# Altium schematic sheet bot_schem_rev10_3.SchDoc
size A
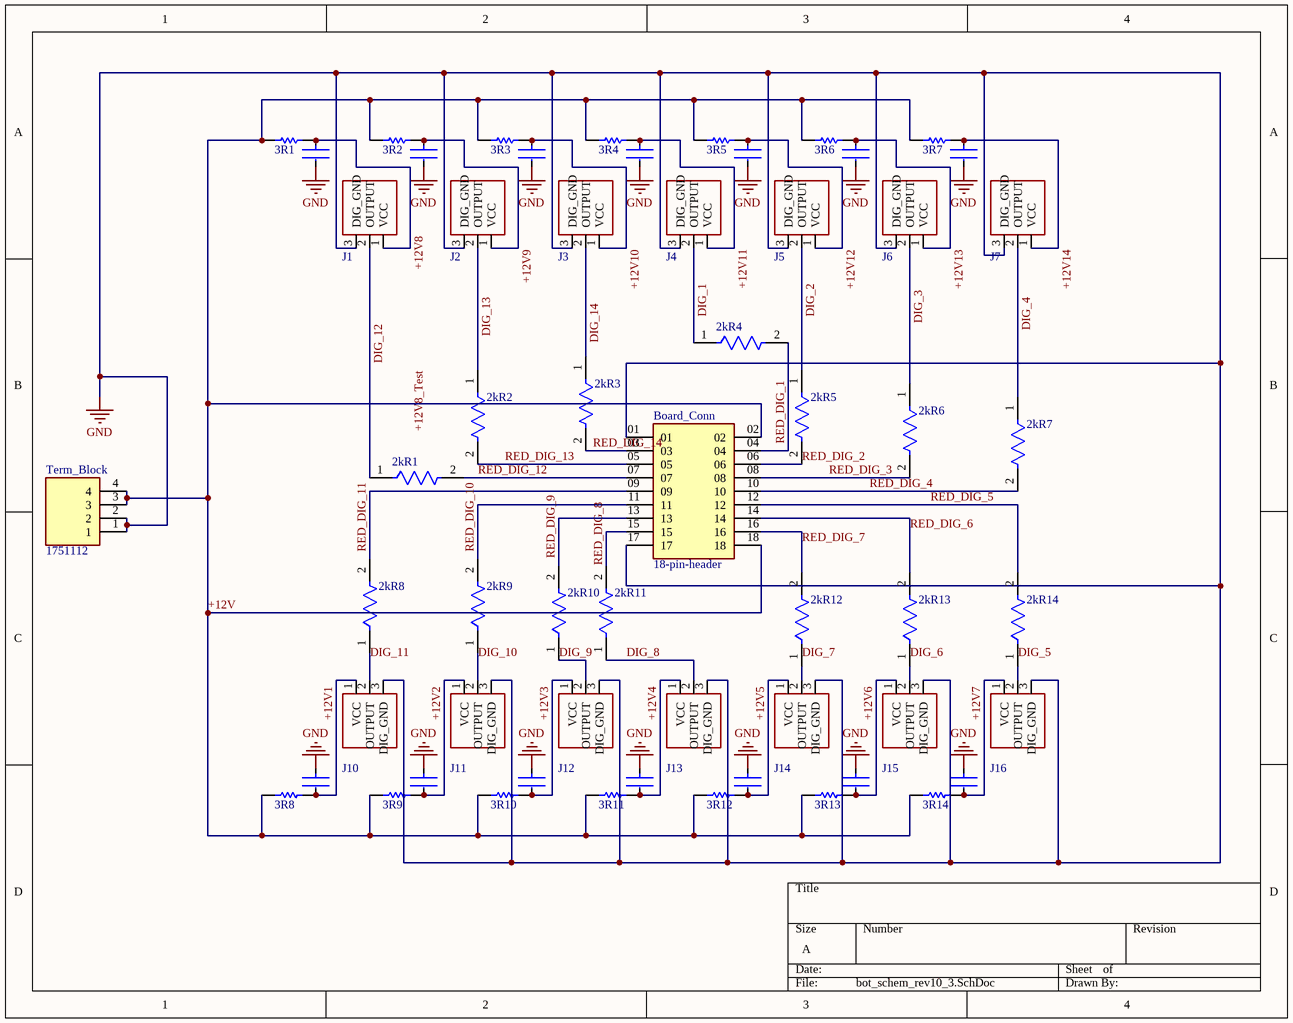
[diagram p0: bot_schem_rev10_3.SchDoc]

## Parts
2kR1  CRCW06031K80FKEA  [2kOhm]  (value not drawn)
2kR2  CRCW06031K80FKEA  [2kOhm]  (value not drawn)
2kR3  CRCW06031K80FKEA  [2kOhm]  (value not drawn)
2kR4  CRCW06031K80FKEA  [2kOhm]  (value not drawn)
2kR5  CRCW06031K80FKEA  [2kOhm]  (value not drawn)
2kR6  CRCW06031K80FKEA  [2kOhm]  (value not drawn)
2kR7  CRCW06031K80FKEA  [2kOhm]  (value not drawn)
2kR8  CRCW06031K80FKEA  [2kOhm]  (value not drawn)
2kR9  CRCW06031K80FKEA  [2kOhm]  (value not drawn)
2kR10  CRCW06031K80FKEA  [2kOhm]  (value not drawn)
2kR11  CRCW06031K80FKEA  [2kOhm]  (value not drawn)
2kR12  CRCW06031K80FKEA  [2kOhm]  (value not drawn)
2kR13  CRCW06031K80FKEA  [2kOhm]  (value not drawn)
2kR14  CRCW06031K80FKEA  [2kOhm]  (value not drawn)
3R1  ERJ-8GEYJ3R0V  [3 ohm]  (value not drawn)
3R2  ERJ-8GEYJ3R0V  [3 ohm]  (value not drawn)
3R3  ERJ-8GEYJ3R0V  [3 ohm]  (value not drawn)
3R4  ERJ-8GEYJ3R0V  [3 ohm]  (value not drawn)
3R5  ERJ-8GEYJ3R0V  [3 ohm]  (value not drawn)
3R6  ERJ-8GEYJ3R0V  [3 ohm]  (value not drawn)
3R7  ERJ-8GEYJ3R0V  [3 ohm]  (value not drawn)
3R8  ERJ-8GEYJ3R0V  [3 ohm]  (value not drawn)
3R9  ERJ-8GEYJ3R0V  [3 ohm]  (value not drawn)
3R10  ERJ-8GEYJ3R0V  [3 ohm]  (value not drawn)
3R11  ERJ-8GEYJ3R0V  [3 ohm]  (value not drawn)
3R12  ERJ-8GEYJ3R0V  [3 ohm]  (value not drawn)
3R13  ERJ-8GEYJ3R0V  [3 ohm]  (value not drawn)
3R14  ERJ-8GEYJ3R0V  [3 ohm]  (value not drawn)
Board_Conn  18-pin-header  [18 pin header]
C1  C0805C104K5RACTU  [100nF]  (value not drawn)
C2  C0805C104K5RACTU  [100nF]  (value not drawn)
C3  C0805C104K5RACTU  [100nF]  (value not drawn)
C4  C0805C104K5RACTU  [100nF]  (value not drawn)
C5  C0805C104K5RACTU  [100nF]  (value not drawn)
C6  C0805C104K5RACTU  [100nF]  (value not drawn)
C7  C0805C104K5RACTU  [100nF]  (value not drawn)
C8  C0805C104K5RACTU  [100nF]  (value not drawn)
C9  C0805C104K5RACTU  [100nF]  (value not drawn)
C10  C0805C104K5RACTU  [100nF]  (value not drawn)
C11  C0805C104K5RACTU  [100nF]  (value not drawn)
C12  C0805C104K5RACTU  [100nF]  (value not drawn)
C13  C0805C104K5RACTU  [100nF]  (value not drawn)
C14  C0805C104K5RACTU  [100nF]  (value not drawn)
J1  IF-D95T  [IF-D95]  (value not drawn)
J2  IF-D95T  [IF-D95]  (value not drawn)
J3  IF-D95T  [IF-D95]  (value not drawn)
J4  IF-D95T  [IF-D95]  (value not drawn)
J5  IF-D95T  [IF-D95]  (value not drawn)
J6  IF-D95T  [IF-D95]  (value not drawn)
J7  IF-D95T  [IF-D95]  (value not drawn)
J10  IF-D95T  [IF-D95]  (value not drawn)
J11  IF-D95T  [IF-D95]  (value not drawn)
J12  IF-D95T  [IF-D95]  (value not drawn)
J13  IF-D95T  [IF-D95]  (value not drawn)
J14  IF-D95T  [IF-D95]  (value not drawn)
J15  IF-D95T  [IF-D95]  (value not drawn)
J16  IF-D95T  [IF-D95]  (value not drawn)
Term_Block  1751112  [4-pin terminal HORIZONTAL]

## Nets
GND: Board_Conn.01 Board_Conn.17 C1.2 C2.2 C3.2 C4.2 C5.2 C6.2 C7.2 C8.1 C9.1 C10.1 C11.1 C12.1 C13.1 C14.1 J1.3(DIG_GND) J2.3(DIG_GND) J3.3(DIG_GND) J4.3(DIG_GND) J5.3(DIG_GND) J6.3(DIG_GND) J7.3(DIG_GND) J10.3(DIG_GND) J11.3(DIG_GND) J12.3(DIG_GND) J13.3(DIG_GND) J14.3(DIG_GND) J15.3(DIG_GND) J16.3(DIG_GND) Term_Block.1 Term_Block.2
+12V: 3R1.1 3R2.1 3R3.1 3R4.1 3R5.1 3R6.1 3R7.1 3R8.1 3R9.1 3R10.1 3R11.1 3R12.1 3R13.1 3R14.1 Board_Conn.02 Board_Conn.18 Term_Block.3 Term_Block.4
+12V1: 3R8.2 C8.2 J10.1(VCC)
+12V2: 3R9.2 C9.2 J11.1(VCC)
+12V3: 3R10.2 C10.2 J12.1(VCC)
+12V4: 3R11.2 C11.2 J13.1(VCC)
+12V5: 3R12.2 C12.2 J14.1(VCC)
+12V6: 3R13.2 C13.2 J15.1(VCC)
+12V7: 3R14.2 C14.2 J16.1(VCC)
+12V8: 3R1.2 C1.1 J1.1(VCC)
+12V9: 3R2.2 C2.1 J2.1(VCC)
+12V10: 3R3.2 C3.1 J3.1(VCC)
+12V11: 3R4.2 C4.1 J4.1(VCC)
+12V12: 3R5.2 C5.1 J5.1(VCC)
+12V13: 3R6.2 C6.1 J6.1(VCC)
+12V14: 3R7.2 C7.1 J7.1(VCC)
DIG_1: 2kR4.1 J4.2(OUTPUT)
DIG_2: 2kR5.1 J5.2(OUTPUT)
DIG_3: 2kR6.1 J6.2(OUTPUT)
DIG_4: 2kR7.1 J7.2(OUTPUT)
DIG_8: 2kR11.1 J13.2(OUTPUT)
DIG_9: 2kR10.1 J12.2(OUTPUT)
DIG_10: 2kR9.1 J11.2(OUTPUT)
DIG_11: 2kR8.1 J10.2(OUTPUT)
DIG_12: 2kR1.1 J1.2(OUTPUT)
DIG_13: 2kR2.1 J2.2(OUTPUT)
DIG_14: 2kR3.1 J3.2(OUTPUT)
RED_DIG_1: 2kR4.2 Board_Conn.04
RED_DIG_2: 2kR5.2 Board_Conn.06
RED_DIG_3: 2kR6.2 Board_Conn.08
RED_DIG_4: 2kR7.2 Board_Conn.10
RED_DIG_5: 2kR14.2 Board_Conn.12
RED_DIG_6: 2kR13.2 Board_Conn.14
RED_DIG_7: 2kR12.2 Board_Conn.16
RED_DIG_8: 2kR11.2 Board_Conn.15
RED_DIG_9: 2kR10.2 Board_Conn.13
RED_DIG_10: 2kR9.2 Board_Conn.11
RED_DIG_11: 2kR8.2 Board_Conn.09
RED_DIG_12: 2kR1.2 Board_Conn.07
RED_DIG_13: 2kR2.2 Board_Conn.05
RED_DIG_14: 2kR3.2 Board_Conn.03
Net2kR12_1: 2kR12.1 J14.2(OUTPUT)
Net2kR13_1: 2kR13.1 J15.2(OUTPUT)
Net2kR14_1: 2kR14.1 J16.2(OUTPUT)

## Notes on the sheet
- Labels drawn without touching a wire or pin: +12V8_Test, DIG_5, DIG_6, DIG_7

## Library data of the parts
2kR1-2kR14 = CRCW06031K80FKEA: Res Thick Film 0603 1.8K Ohm 1% 1/10W ±100ppm/°C Molded SMD Paper T/R; Manufacturer: Vishay; Resistance: 1.8kR; Power Rating: 100mW; Voltage Rating: 75V; Supplier 1: RSComponents; Manufacturer Part Number: CRCW06031K80FKEA; RoHS: Yes; Category: Chip SMD Resistors; Stock 1: 7900; Pricing 1: 50=0.06500, 500=0.06000, 1000=0.05600, 2000=0.05200, 4000=0.04800 (USD); Case/Package: 0603; Case Code (Metric): 1608; Case Code (Imperial): 0603; Contact Plating: Tin; Weight: 7.1E-05oz; Size Code: 0603; Min Operating Temperature: -55°C; Max Operating Temperature: 155°C; Resistor Type: Thick Film; Tolerance: 1%; Packaging: Tape and Reel; Package Quantity: 5000; Temperature Coefficient: 100ppm/°C; Series: CRCW; Resistance Tolerance: 1%; Number of Terminations: 2; Max Power Dissipation: 100mW; Termination: SMD/SMT; Construction: Rectangular; Voltage Rating (DC): 75V; Features: Automotive AEC-Q200; Technology: THICK FILM; Length: 1.55mm; Width: 0.033inch; Height: 0.45mm; Depth: 0.85mm; Radiation Hardening: No; RoHS Compliant: Yes; REACH SVHC: Unknown; Military Standard: Not; Lead Free: Lead Free; ComponentLink1URL: https://datasheet.ciiva.com/11809/0900766b80d98afc-11809198.pdf?src-supplier=RSComponents; ComponentLink1Description: https://datasheet.ciiva.com/11809/0900766b80d98afc-11809198.pdf?src-supplier=RSComponents; ComponentLink2URL: https://datasheet.ciiva.com/2559/dcrcwe3-2559458.pdf?src-supplier=Digi-Key; ComponentLink2Description: https://datasheet.ciiva.com/2559/dcrcwe3-2559458.pdf?src-supplier=Digi-Key; ComponentLink3URL: https://datasheet.ciiva.com/2559/dcrcwe3-2559459.pdf?src-supplier=Digi-Key; ComponentLink3Description: https://datasheet.ciiva.com/2559/dcrcwe3-2559459.pdf?src-supplier=Digi-Key; ComponentLink4URL: https://datasheet.ciiva.com/2559/dcrcwe3-2559460.pdf?src-supplier=Digi-Key; ComponentLink4Description: https://datasheet.ciiva.com/2559/dcrcwe3-2559460.pdf?src-supplier=Digi-Key; ComponentLink5URL: https://datasheet.ciiva.com/3257/dcrcwe3-3257191.pdf?src-supplier=Avnet; ComponentLink5Description: https://datasheet.ciiva.com/3257/dcrcwe3-3257191.pdf?src-supplier=Avnet; ComponentLink6URL: https://datasheet.ciiva.com/5547/dcrcwe3-109170-5547689.pdf?src-supplier=Mouser; ComponentLink6Description: https://datasheet.ciiva.com/5547/dcrcwe3-109170-5547689.pdf?src-supplier=Mouser; ComponentLink7URL: https://datasheet.ciiva.com/26314/fld-crcw-e3-data-en-26314680.pdf?src-supplier=Distrelec; ComponentLink7Description: https://datasheet.ciiva.com/26314/fld-crcw-e3-data-en-26314680.pdf?src-supplier=Distrelec; ComponentLink8URL: https://datasheet.ciiva.com/22872/70201119-22872444.pdf?src-supplier=Allied+Electronics; ComponentLink8Description: https://datasheet.ciiva.com/22872/70201119-22872444.pdf?src-supplier=Allied+Electronics; ComponentLink9URL: https://datasheet.ciiva.com/7673/1533075-7673143.pdf?src-supplier=Element14; ComponentLink9Description: https://datasheet.ciiva.com/7673/1533075-7673143.pdf?src-supplier=Element14
3R1-3R14 = ERJ-8GEYJ3R0V: Res Thick Film 1206 3 Ohm 5% 1/4W -100ppm/C to 600ppm/C Molded SMD Punched Carrier T/R; Manufacturer: Panasonic; Resistance: 3R; Temperature Coefficient: 600ppm/°C; Power Rating: 250mW; Voltage Rating: 200V; Supplier 1: Digi-Key; Supplier Part Number 1: P3.0ECT-ND; Manufacturer Part Number: ERJ-8GEYJ3R0V; RoHS: Yes; Category: Chip SMD Resistors; Stock 1: 140112; Pricing 1: 1=0.10000, 10=0.05900, 100=0.02420, 1000=0.01087, 2500=0.00943 (USD); Mount: Surface Mount; Case/Package: 1206; Case Code (Metric): 3216; Case Code (Imperial): 1206; Contact Plating: Tin; Min Operating Temperature: -55°C; Max Operating Temperature: 155°C; Tolerance: 5%; Packaging: Tape and Reel; Resistor Type: Thick Film; Number of Terminations: 2; Max Power Dissipation: 250mW; Voltage Rating (DC): 200V; Package Quantity: 1; Features: Automotive AEC-Q200; Series: ERJ; Construction: Rectangular; Resistance Tolerance: 5%; Length: 3.2mm; Width: 0.063inch; Height: 0.028inch; Depth: 1.6mm; Radiation Hardening: No; Lead Free: Lead Free; RoHS Compliant: Yes; Military Standard: Not; REACH SVHC: No SVHC; ComponentLink1URL: https://datasheet.ciiva.com/30180/4aoa0000ce1-30180605.pdf?src-supplier=Onlinecomponents.com; ComponentLink1Description: https://datasheet.ciiva.com/30180/4aoa0000ce1-30180605.pdf?src-supplier=Onlinecomponents.com; ComponentLink2URL: https://datasheet.ciiva.com/17213/aoa0000ce1-17213823.pdf?src-supplier=Avnet+Europe; ComponentLink2Description: https://datasheet.ciiva.com/17213/aoa0000ce1-17213823.pdf?src-supplier=Avnet+Europe; ComponentLink3URL: https://datasheet.ciiva.com/46387/1500035-46387035.pdf?src-supplier=Element14; ComponentLink3Description: https://datasheet.ciiva.com/46387/1500035-46387035.pdf?src-supplier=Element14; ComponentLink4URL: https://datasheet.ciiva.com/46374/1500035-46374140.pdf?src-supplier=Element14; ComponentLink4Description: https://datasheet.ciiva.com/46374/1500035-46374140.pdf?src-supplier=Element14; ComponentLink5URL: https://datasheet.ciiva.com/9196/aoa0000ce1-9196703.pdf?src-supplier=Avnet; ComponentLink5Description: https://datasheet.ciiva.com/9196/aoa0000ce1-9196703.pdf?src-supplier=Avnet
Board_Conn = 18-pin-header: System: Connector
C1-C14 = C0805C104K5RACTU: Cap Ceramic 0.1uF 50V X7R 10% SMD 2.0 x 1.2 mm 125 C Paper T/R; Manufacturer: KEMET; Voltage: 500V; Supplier 1: Digi-Key; Supplier Part Number 1: 399-1170-1-ND; Manufacturer Part Number: C0805C104K5RACTU; RoHS: Yes; Category: Ceramic Capacitors; Stock 1: 2447786; Pricing 1: 1=0.15000, 10=0.11000, 50=0.06220, 100=0.05150, 500=0.03612, 1000=0.02991 (USD); Mount: Surface Mount,PCB; Case/Package: 0805; Number of Pins: 2; Case Code (Imperial): 0805; Case Code (Metric): 2012; Contact Plating: Tin,Matte; Dielectric Material: Ceramic; Min Operating Temperature: -55°C; Max Operating Temperature: 125°C; Capacitance: 100nF; Voltage Rating: 50V; Tolerance: 10%; Packaging: Tape and Reel; Dielectric: X7R; Package Quantity: 4000; Voltage Rating (DC): 50V; Series: C0805C; Termination: SMD/SMT; Construction: Flat; Length: 2mm; Width: 1.2mm; Height: 0.9mm; Thickness: 0.035inch; Depth: 1.25mm; Lead Pitch: 0.75mm; Radiation Hardening: No; RoHS Compliant: Yes; REACH SVHC: No SVHC; ComponentLink1URL: https://datasheet.ciiva.com/28682/1851736-28682232.pdf?src-supplier=Element14; ComponentLink1Description: https://datasheet.ciiva.com/28682/1851736-28682232.pdf?src-supplier=Element14; ComponentLink2URL: https://datasheet.ciiva.com/14589/70095383-14589048.pdf?src-supplier=Allied+Electronics; ComponentLink2Description: https://datasheet.ciiva.com/14589/70095383-14589048.pdf?src-supplier=Allied+Electronics; ComponentLink3URL: https://datasheet.ciiva.com/32431/slceramic-chip-condensers-e-32431755.pdf?src-supplier=Distrelec; ComponentLink3Description: https://datasheet.ciiva.com/32431/slceramic-chip-condensers-e-32431755.pdf?src-supplier=Distrelec; ComponentLink4URL: https://datasheet.ciiva.com/18410/70095383-18410815.pdf?src-supplier=Allied+Electronics; ComponentLink4Description: https://datasheet.ciiva.com/18410/70095383-18410815.pdf?src-supplier=Allied+Electronics
J1-J7 J10-J16 = IF-D95T: DETECTOR PHOTOLOGIC TTL/CMOS; Manufacturer: Industrial Fiber Optics; Data Rate: 125Kbps; Operating Supply Current: 6mA; Rise Time: 70ns; Supplier 1: Digi-Key; Supplier Part Number 1: FB123-ND; Manufacturer Part Number: IF-D95T; RoHS: No; Category: Fiber Optic Cables; Package Quantity: 50; Lead Free: Contains Lead; ComponentLink1URL: https://datasheet.ciiva.com/2106/ifd95-2106550.pdf?src-supplier=Digi-Key; ComponentLink1Description: https://datasheet.ciiva.com/2106/ifd95-2106550.pdf?src-supplier=Digi-Key